# Altium project Motor_Driver.PrjPcb
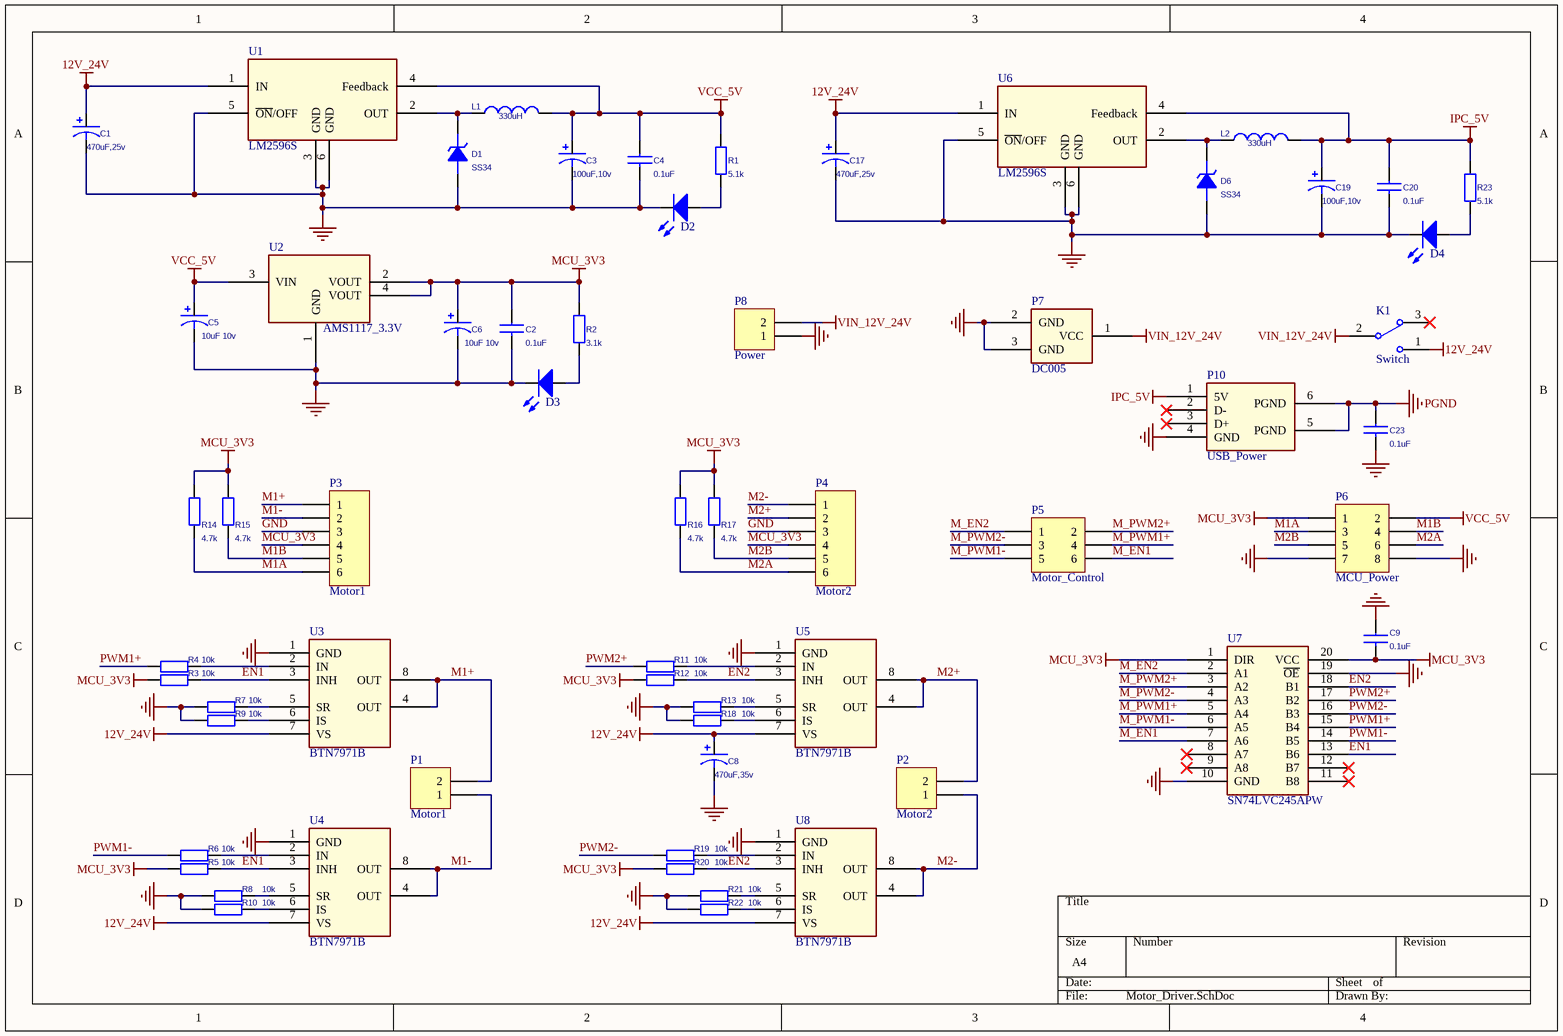
[diagram p0: Motor_Driver.SchDoc]
1 sheet, 60 parts. Net scope: global (net labels, ports and power ports of the same name join across sheets).
Board file: Motor_Driver.PcbDoc

## Sheet Motor_Driver.SchDoc
size A4

### Parts
C1  470uF,25v  [SMD8102_C]
C2  0.1uF  [0805_C]
C3  100uF,10v  [CAP_CASE_C_6032]
C4  0.1uF  [0805_C]
C5  10uF 10v  [CAP_CASE_A_3216]
C6  10uF 10v  [CAP_CASE_A_3216]
C8  470uF,35v  [SMD8102_C]
C9  0.1uF  [0805_C]
C17  470uF,25v  [SMD8102_C]
C19  100uF,10v  [CAP_CASE_C_6032]
C20  0.1uF  [0805_C]
C23  0.1uF  [0805_C]
D1  SS34  [SMA(DO-214AC)]
D2  LED_0603  [0603_LED]  (value not drawn)
D3  LED_0603  [0603_LED]  (value not drawn)
D4  LED_0603  [0603_LED]  (value not drawn)
D6  SS34  [SMA(DO-214AC)]
K1  Switch  [Switch_Key3]
L1  330uH  [SMD0707_L]
L2  330uH  [SMD0707_L]
P1  Motor1  [HT3.96_Power]
P2  Motor2  [HT3.96_Power]
P3  Motor1  [PH2.0_P6]
P4  Motor2  [PH2.0_P6]
P5  Motor_Control  [Connect_3×2]
P6  MCU_Power  [CONNECT_4×2]
P7  DC005  [DC005]
P8  Power  [HT3.96_Power]
P10  USB_Power  [USB_Pin6]
R1  5.1k  [0805_R]
R2  3.1k  [0805_R]
R3  10k  [0805_R]
R4  10k  [0805_R]
R5  10k  [0805_R]
R6  10k  [0805_R]
R7  10k  [0805_R]
R8  10k  [0805_R]
R9  10k  [0805_R]
R10  10k  [0805_R]
R11  10k  [0805_R]
R12  10k  [0805_R]
R13  10k  [0805_R]
R14  4.7k  [0805_R]
R15  4.7k  [0805_R]
R16  4.7k  [0805_R]
R17  4.7k  [0805_R]
R18  10k  [0805_R]
R19  10k  [0805_R]
R20  10k  [0805_R]
R21  10k  [0805_R]
R22  10k  [0805_R]
R23  5.1k  [0805_R]
U1  LM2596S  [LM2596S]
U2  AMS1117_3.3V  [LM1117]
U3  BTN7971B  [BTN7971B]
U4  BTN7971B  [BTN7971B]
U5  BTN7971B  [BTN7971B]
U6  LM2596S  [LM2596S]
U7  SN74LVC245APW  [SN74LVC245APW]
U8  BTN7971B  [BTN7971B]

### Nets
12V_24V: C1.1 C8.1 C17.1 K1.1 U1.1(IN) U3.7(VS) U4.7(VS) U5.7(VS) U6.1(IN) U8.7(VS)
GND: C1.2 C2.2 C3.2 C4.2 C5.2 C6.2 C8.2 C9.1 C17.2 C19.2 C20.2 C23.2 D1.2(ANODE) D2.K D3.K D4.K D6.2(ANODE) P3.3 P4.3 P6.7 P6.8 P7.2(GND) P7.3(GND) P8.1 P10.4(GND) R7.2 R8.1 R9.2 R10.1 R13.2 R18.2 R21.1 R22.1 U1.3(GND) U1.5(~{ON}/OFF) U1.6(GND) U2.1(GND) U3.1(GND) U4.1(GND) U5.1(GND) U6.3(GND) U6.5(~{ON}/OFF) U6.6(GND) U7.10(GND) U7.19(~{OE}) U8.1(GND)
IPC_5V: C19.1 C20.1 L2.2 P10.1(5V) R23.2 U6.4(Feedback)
MCU_3V3: C2.1 C6.1 C9.2 P3.4 P4.4 P6.1 R2.2 R3.2 R5.1 R12.2 R14.2 R15.2 R16.2 R17.2 R20.1 U2.2(VOUT) U2.4(VOUT) U7.1(DIR) U7.20(VCC)
PGND: C23.1 P10.5(PGND) P10.6(PGND)
VCC_5V: C3.1 C4.1 C5.1 L1.2 P6.2 R1.2 U1.4(Feedback) U2.3(VIN)
VIN_12V_24V: K1.2 P7.1(VCC) P8.2
EN1: R3.1 R5.2 U3.3(INH) U4.3(INH) U7.13(B6)
EN2: R12.1 R20.2 U5.3(INH) U7.18(B1) U8.3(INH)
M1+: P1.2 P3.1 U3.4(OUT) U3.8(OUT)
M1-: P1.1 P3.2 U4.4(OUT) U4.8(OUT)
M1A: P3.6 P6.3 R14.1
M1B: P3.5 P6.4 R15.1
M2+: P2.2 P4.2 U5.4(OUT) U5.8(OUT)
M2-: P2.1 P4.1 U8.4(OUT) U8.8(OUT)
M2A: P4.6 P6.6 R16.1
M2B: P4.5 P6.5 R17.1
M_EN1: P5.6 U7.7(A6)
M_EN2: P5.1 U7.2(A1)
M_PWM1+: P5.4 U7.5(A4)
M_PWM1-: P5.5 U7.6(A5)
M_PWM2+: P5.2 U7.3(A2)
M_PWM2-: P5.3 U7.4(A3)
PWM1+: R4.2 U7.15(B4)
PWM1-: R6.1 U7.14(B5)
PWM2+: R11.2 U7.17(B2)
PWM2-: R19.1 U7.16(B3)
NetD1_1: D1.1(CATHODE) L1.1 U1.2(OUT)
NetD2_A: D2.A R1.1
NetD3_A: D3.A R2.1
NetD4_A: D4.A R23.1
NetD6_1: D6.1(CATHODE) L2.1 U6.2(OUT)
NetR4_1: R4.1 U3.2(IN)
NetR6_2: R6.2 U4.2(IN)
NetR7_1: R7.1 U3.5(SR)
NetR8_2: R8.2 U4.5(SR)
NetR9_1: R9.1 U3.6(IS)
NetR10_2: R10.2 U4.6(IS)
NetR11_1: R11.1 U5.2(IN)
NetR13_1: R13.1 U5.5(SR)
NetR18_1: R18.1 U5.6(IS)
NetR19_2: R19.2 U8.2(IN)
NetR21_2: R21.2 U8.5(SR)
NetR22_2: R22.2 U8.6(IS)

Not connected (* = marked no-connect by the designer): K1 3*; P10 2(D-)* 3(D+)*; U7 8(A7)* 9(A8)* 11(B8)* 12(B7)*

### Library data of the parts
C1 C3 C5 C6 C8 C17 C19 = Cap_Polar
C2 C4 C9 C20 C23 = Cap
D1 D6 = Diode_Zener
D2-D4 = LED
K1 = Switch_Key3
L1 L2 = Inductor
P1 P2 P8 = HT3.96_Power
P3 P4 = PH2.0_P6
P5 = Connect_3×2
P6 = Connect_4×2
P10 = USB_Pin6
R1-R23 = Res